# Altium schematic sheet ММС схема D650 Э3.SchDoc
size 850 x 604 mm; TypeD: Схема электрическая принципиальная; Name: ММС (схема D650)
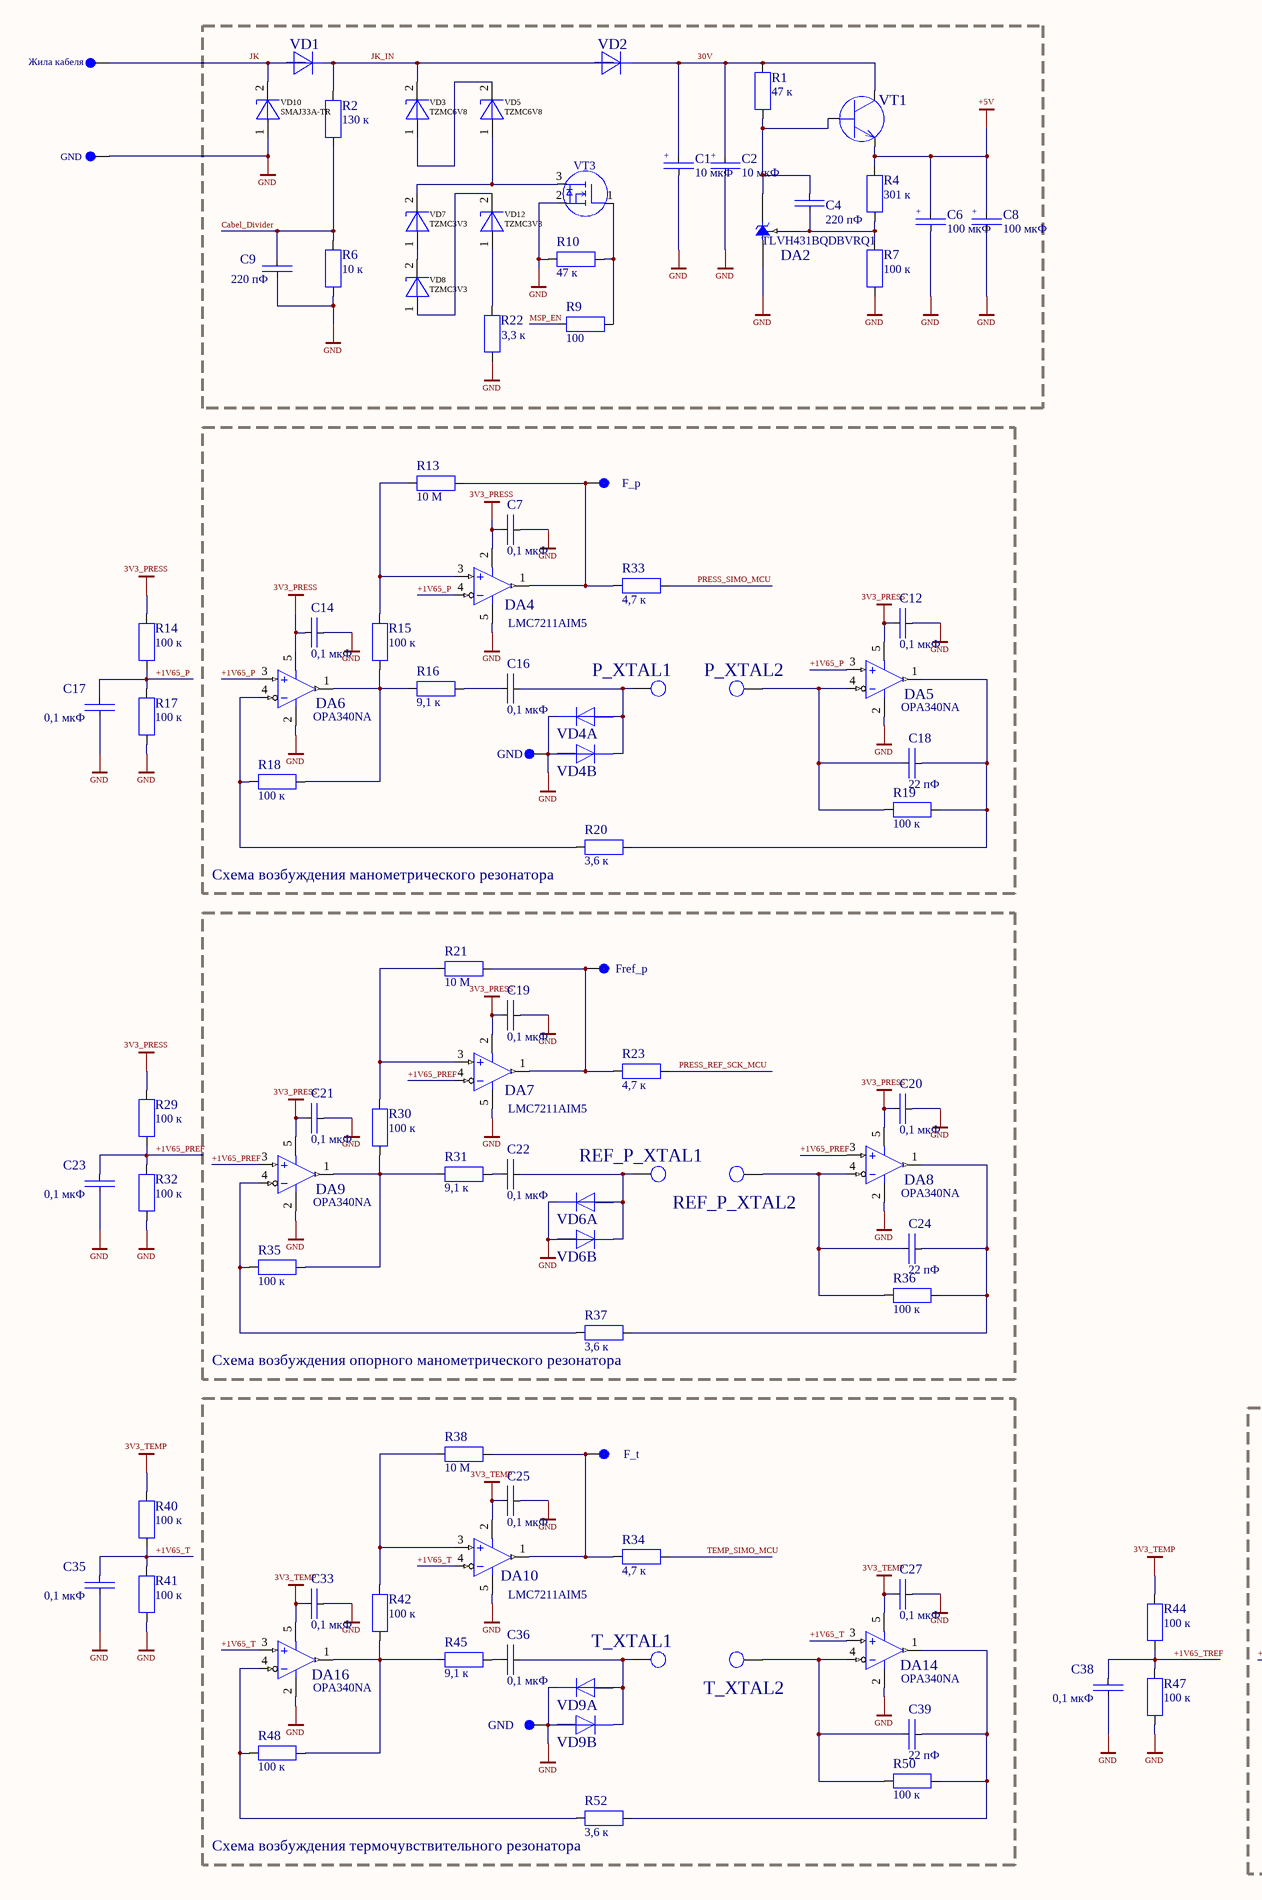
[diagram p0: ММС схема D650 Э3.SchDoc, left]
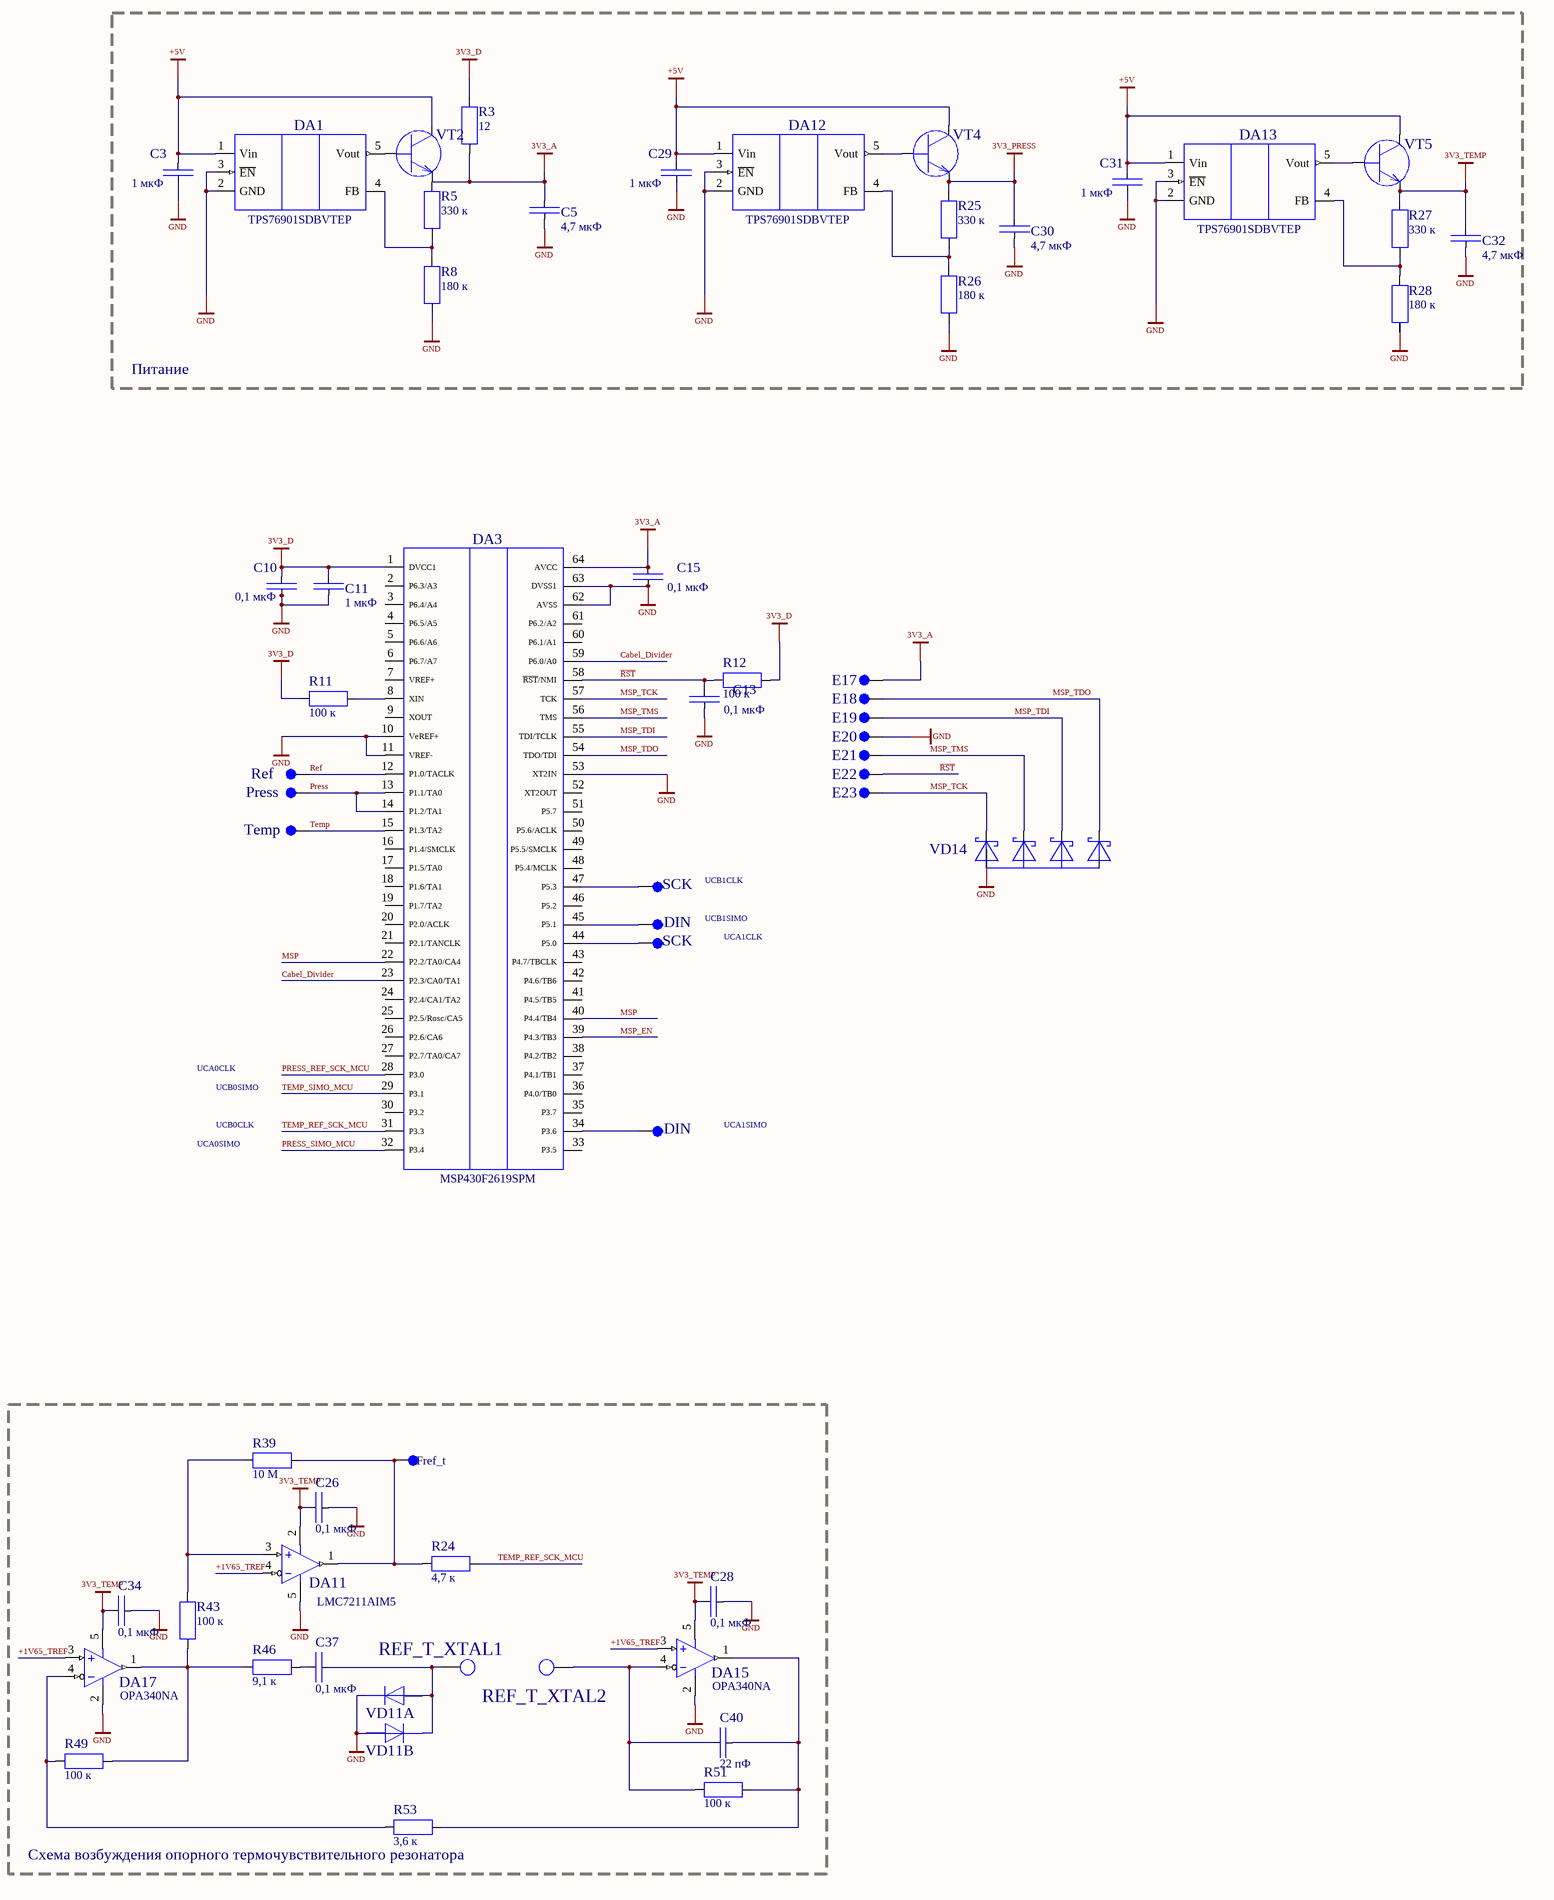
[diagram p1: ММС схема D650 Э3.SchDoc, right]

## Parts
C1  10 мкФ
C2  10 мкФ
C3  1 мкФ  [CC0603]
C4  220 пФ  [CC0603]
C5  4,7 мкФ  [CC0805]
C6  100 мкФ
C7  0,1 мкФ  [CC0603]
C8  100 мкФ
C9  220 пФ  [CC0603]
C10  0,1 мкФ  [CC0603]
C11  1 мкФ  [CC0603]
C12  0,1 мкФ  [CC0603]
C13  0,1 мкФ  [CC0603]
C14  0,1 мкФ  [CC0603]
C15  0,1 мкФ  [CC0603]
C16  0,1 мкФ  [CC0603]
C17  0,1 мкФ  [CC0603]
C18  22 пФ  [CC0603]
C19  0,1 мкФ  [CC0603]
C20  0,1 мкФ  [CC0603]
C21  0,1 мкФ  [CC0603]
C22  0,1 мкФ  [CC0603]
C23  0,1 мкФ  [CC0603]
C24  22 пФ  [CC0603]
C25  0,1 мкФ  [CC0603]
C26  0,1 мкФ  [CC0603]
C27  0,1 мкФ  [CC0603]
C28  0,1 мкФ  [CC0603]
C29  1 мкФ  [CC0603]
C30  4,7 мкФ  [CC0805]
C31  1 мкФ  [CC0603]
C32  4,7 мкФ  [CC0805]
C33  0,1 мкФ  [CC0603]
C34  0,1 мкФ  [CC0603]
C35  0,1 мкФ  [CC0603]
C36  0,1 мкФ  [CC0603]
C37  0,1 мкФ  [CC0603]
C38  0,1 мкФ  [CC0603]
C39  22 пФ  [CC0603]
C40  22 пФ  [CC0603]
DA1  TPS76901SDBVTEP  [SOT23-5]
DA2  TLVH431BQDBVRQ1  [SOT23-5]
DA3  MSP430F2619SPM  [LQFP64_SMALL PADS]
DA4  LMC7211AIM5  [SOT23-5]
DA5  OPA340NA  [SOT23-5]
DA6  OPA340NA  [SOT23-5]
DA7  LMC7211AIM5  [SOT23-5]
DA8  OPA340NA  [SOT23-5]
DA9  OPA340NA  [SOT23-5]
DA10  LMC7211AIM5  [SOT23-5]
DA11  LMC7211AIM5  [SOT23-5]
DA12  TPS76901SDBVTEP  [SOT23-5]
DA13  TPS76901SDBVTEP  [SOT23-5]
DA14  OPA340NA  [SOT23-5]
DA15  OPA340NA  [SOT23-5]
DA16  OPA340NA  [SOT23-5]
DA17  OPA340NA  [SOT23-5]
E1  Жила кабеля  [Holes_x2]  (no BOM)
E2  GND  [Holes_x2]  (no BOM)
E3  F_p  [KT08X15]  (no BOM)
E4  Fref_p  [KT08X15]  (no BOM)
E5  F_t  [KT08X15]  (no BOM)
E6  GND  [KT08X15]  (no BOM)
E7  GND  [KT08X15]  (no BOM)
E8  P_XTAL1  [HOLES_1 mm]  (no BOM)
E9  T_XTAL1  [HOLES_1 mm]  (no BOM)
E10  REF_P_XTAL1  [HOLES_1 mm]  (no BOM)
E11  P_XTAL2  [HOLES_1 mm]  (no BOM)
E12  REF_P_XTAL2  [HOLES_1 mm]  (no BOM)
E13  T_XTAL2  [HOLES_1 mm]  (no BOM)
E14  Fref_t  [KT08X15]  (no BOM)
E15  REF_T_XTAL1  [HOLES_1 mm]  (no BOM)
E16  REF_T_XTAL2  [HOLES_1 mm]  (no BOM)
E17  KP  [EDGE HOLE]  (value not drawn)  (no BOM)
E18  KP  [EDGE HOLE]  (value not drawn)  (no BOM)
E19  KP  [EDGE HOLE]  (value not drawn)  (no BOM)
E20  KP  [EDGE HOLE]  (value not drawn)  (no BOM)
E21  KP  [EDGE HOLE]  (value not drawn)  (no BOM)
E22  KP  [EDGE HOLE]  (value not drawn)  (no BOM)
E23  KP  [EDGE HOLE]  (value not drawn)  (no BOM)
E24  SCK  [0.4x0.8mm]  (no BOM)
E25  DIN  [0.4x0.8mm]  (no BOM)
E26  SCK  [0.4x0.8mm]  (no BOM)
E27  DIN  [0.4x0.8mm]  (no BOM)
E31  Ref  [0.4x0.8mm]  (no BOM)
E32  Press  [0.4x0.8mm]  (no BOM)
E33  Temp  [0.4x0.8mm]  (no BOM)
R1  47 к  [RC0805]
R2  130 к  [RC0805]
R3  12  [RC0603]
R4  301 к  [RC0603]
R5  330 к  [RC0603]
R6  10 к  [RC0603]
R7  100 к  [RC0603]
R8  180 к  [RC0603]
R9  100  [RC0603]
R10  47 к  [RC0603]
R11  100 к  [RC0603]
R12  100 к  [RC0603]
R13  10 М  [RC0603]
R14  100 к  [RC0603]
R15  100 к  [RC0603]
R16  9,1 к  [RC0603]
R17  100 к  [RC0603]
R18  100 к  [RC0603]
R19  100 к  [RC0603]
R20  3,6 к  [RC0603]
R21  10 М  [RC0603]
R22  3,3 к
R23  4,7 к  [RC0603]
R24  4,7 к  [RC0603]
R25  330 к  [RC0603]
R26  180 к  [RC0603]
R27  330 к  [RC0603]
R28  180 к  [RC0603]
R29  100 к  [RC0603]
R30  100 к  [RC0603]
R31  9,1 к  [RC0603]
R32  100 к  [RC0603]
R33  4,7 к  [RC0603]
R34  4,7 к  [RC0603]
R35  100 к  [RC0603]
R36  100 к  [RC0603]
R37  3,6 к  [RC0603]
R38  10 М  [RC0603]
R39  10 М  [RC0603]
R40  100 к  [RC0603]
R41  100 к  [RC0603]
R42  100 к  [RC0603]
R43  100 к  [RC0603]
R44  100 к  [RC0603]
R45  9,1 к  [RC0603]
R46  9,1 к  [RC0603]
R47  100 к  [RC0603]
R48  100 к  [RC0603]
R49  100 к  [RC0603]
R50  100 к  [RC0603]
R51  100 к  [RC0603]
R52  3,6 к  [RC0603]
R53  3,6 к  [RC0603]
VD1  (no value)  [SMA(DO-214AC)]
VD2  (no value)  [MiniMELF(SOD-80)]
VD3  TZMC6V8  [MiniMelf(SOD-80)]
VD4  BAV99T  [SOT523]  (value not drawn)  (parts A,B of 2)
VD5  TZMC6V8  [MiniMelf(SOD-80)]
VD6  BAV99T  [SOT523]  (value not drawn)  (parts A,B of 2)
VD7  TZMC3V3  [MiniMelf(SOD-80)]
VD8  TZMC3V3  [MiniMelf(SOD-80)]
VD9  BAV99T  [SOT523]  (value not drawn)  (parts A,B of 2)
VD10  SMAJ33A-TR  [SMA(DO-214AC)]
VD11  BAV99T  [SOT523]  (value not drawn)  (parts A,B of 2)
VD12  TZMC3V3  [MiniMelf(SOD-80)]
VD14  PESD3V3L4UG,115  [SC70-5]  (value not drawn)
VT1  (no value)  [TO92GOR]
VT2  (no value)  [TO92GOR]
VT3  (no value)  [SOT23-3]
VT4  (no value)  [TO92GOR]
VT5  (no value)  [TO92GOR]

## Blocks framed on the sheet
Питание: C3 C5 C29-C32 DA1 DA12 DA13 R3 R5 R8 R25-R28 VT2 VT4 VT5
Схема возбуждения манометрического резонатора: C7 C12 C14 C16 C18 DA4-DA6 E3 E6 E8 E11 R13 R15 R16 R18-R20 R33 VD4
Схема возбуждения опорного манометрического резонатора: C19-C22 C24 DA7-DA9 E4 E10 E12 R21 R23 R30 R31 R35-R37 VD6
Схема возбуждения термочувствительного резонатора: C25 C27 C33 C36 C39 DA10 DA14 DA16 E5 E7 E9 E13 R34 R38 R42 R45 R48 R50 R52 VD9
Схема возбуждения опорного термочувствительного резонатора: C26 C28 C34 C37 C40 DA11 DA15 DA17 E14-E16 R24 R39 R43 R46 R49 R51 R53 VD11

## Nets
3V3_A: C5.1 C15.1 DA3.64(AVCC) E17.1 R3.1 R5.2 VT2.1(E)
3V3_D: C10.1 C11.1 DA3.1(DVCC1) R3.2 R11.1 R12.2
3V3_PRESS: C7.1 C12.1 C14.1 C19.1 C20.1 C21.1 C30.1 DA4.2(V+) DA5.5(V+) DA6.5(V+) DA7.2(V+) DA8.5(V+) DA9.5(V+) R14.2 R25.2 R29.2 VT4.1(E)
3V3_TEMP: C25.1 C26.1 C27.1 C28.1 C32.1 C33.1 C34.1 DA10.2(V+) DA11.2(V+) DA14.5(V+) DA15.5(V+) DA16.5(V+) DA17.5(V+) R27.2 R40.2 R44.2 VT5.1(E)
+5V: C3.1 C6.1 C8.1 C29.1 C31.1 DA1.1(Vin) DA12.1(Vin) DA13.1(Vin) R4.2 VT1.1(E) VT2.3(K) VT4.3(K) VT5.3(K)
GND: C1.2 C2.2 C3.2 C5.2 C6.2 C7.2 C8.2 C9.2 C10.2 C11.2 C12.2 C13.2 C14.2 C15.2 C17.2 C19.2 C20.2 C21.2 C23.2 C25.2 C26.2 C27.2 C28.2 C29.2 C30.2 C31.2 C32.2 C33.2 C34.2 C35.2 C38.2 DA1.2(GND) DA1.3(~{EN}) DA2.5(A) DA3.10(VeREF+) DA3.11(VREF-) DA3.53(XT2IN) DA3.62(AVSS) DA3.63(DVSS1) DA4.5(V-) DA5.2(V-) DA6.2(V-) DA7.5(V-) DA8.2(V-) DA9.2(V-) DA10.5(V-) DA11.5(V-) DA12.2(GND) DA12.3(~{EN}) DA13.2(GND) DA13.3(~{EN}) DA14.2(V-) DA15.2(V-) DA16.2(V-) DA17.2(V-) E2.1 E6.1 E7.1 E20.1 R6.1 R7.1 R8.1 R10.1 R17.1 R22.1 R26.1 R28.1 R32.1 R41.1 R47.1 VD4.1(A2) VD4.2(K1) VD6.1(A2) VD6.2(K1) VD9.1(A2) VD9.2(K1) VD10.1(A) VD11.1(A2) VD11.2(K1) VD14.2(A) VT3.2(S)
30V: C1.1 C2.1 R1.2 VD2.2(K) VT1.3(K)
+1V65_P: C17.1 DA4.4(IN-) DA5.3(IN+) DA6.3(IN+) R14.1 R17.2
+1V65_PREF: C23.1 DA7.4(IN-) DA8.3(IN+) DA9.3(IN+) R29.1 R32.2
+1V65_T: C35.1 DA10.4(IN-) DA14.3(IN+) DA16.3(IN+) R40.1 R41.2
+1V65_TREF: C38.1 DA11.4(IN-) DA15.3(IN+) DA17.3(IN+) R44.1 R47.2
Cabel_Divider: C9.1 DA3.23(P2.3/CA0/TA1) DA3.59(P6.0/A0) R2.1 R6.2
JK: E1.1 VD1.1(A) VD10.2(K)
JK_IN: R2.2 VD1.2(K) VD2.1(A) VD3.2(K)
MSP: DA3.22(P2.2/TA0/CA4) DA3.40(P4.4/TB4)
MSP_EN: DA3.39(P4.3/TB3) R9.1
MSP_TCK: DA3.57(TCK) E23.1 VD14.1(K)
MSP_TDI: DA3.55(TDI/TCLK) E19.1 VD14.4(K)
MSP_TDO: DA3.54(TDO/TDI) E18.1 VD14.5(K)
MSP_TMS: DA3.56(TMS) E21.1 VD14.3(K)
Press: DA3.13(P1.1/TA0) DA3.14(P1.2/TA1) E32.1
PRESS_REF_SCK_MCU: DA3.28(P3.0) R23.2
PRESS_SIMO_MCU: DA3.32(P3.4) R33.2
~{RST}: C13.1 DA3.58(~{RST}/NMI) E22.1 R12.1
Ref: DA3.12(P1.0/TACLK) E31.1
Temp: DA3.15(P1.3/TA2) E33.1
TEMP_REF_SCK_MCU: DA3.31(P3.3) R24.2
TEMP_SIMO_MCU: DA3.29(P3.1) R34.2
NetC4_1: C4.1 DA2.3(K) R1.1 VT1.2(B)
NetC4_2: C4.2 DA2.4(REF) R4.1 R7.2
NetC16_1: C16.1 R16.2
NetC16_2: C16.2 E8.1 VD4.3(K2)
NetC18_1: C18.1 DA5.4(IN-) E11.1 R19.2
NetC18_2: C18.2 DA5.1(OUT) R19.1 R20.2
NetC22_1: C22.1 R31.2
NetC22_2: C22.2 E10.1 VD6.3(K2)
NetC24_1: C24.1 DA8.4(IN-) E12.1 R36.2
NetC24_2: C24.2 DA8.1(OUT) R36.1 R37.2
NetC36_1: C36.1 R45.2
NetC36_2: C36.2 E9.1 VD9.3(K2)
NetC37_1: C37.1 R46.2
NetC37_2: C37.2 E15.1 VD11.3(K2)
NetC39_1: C39.1 DA14.4(IN-) E13.1 R50.2
NetC39_2: C39.2 DA14.1(OUT) R50.1 R52.2
NetC40_1: C40.1 DA15.4(IN-) E16.1 R51.2
NetC40_2: C40.2 DA15.1(OUT) R51.1 R53.2
NetDA1_4: DA1.4(FB) R5.1 R8.2
NetDA1_5: DA1.5(Vout) VT2.2(B)
NetDA3_8: DA3.8(XIN) R11.2
NetDA3_34: DA3.34(P3.6) E27.1
NetDA3_44: DA3.44(P5.0) E26.1
NetDA3_45: DA3.45(P5.1) E25.1
NetDA3_47: DA3.47(P5.3) E24.1
NetDA4_1: DA4.1(OUT) E3.1 R13.2 R33.1
NetDA4_3: DA4.3(IN+) R13.1 R15.2
NetDA6_1: DA6.1(OUT) R15.1 R16.1 R18.1
NetDA6_4: DA6.4(IN-) R18.2 R20.1
NetDA7_1: DA7.1(OUT) E4.1 R21.2 R23.1
NetDA7_3: DA7.3(IN+) R21.1 R30.2
NetDA9_1: DA9.1(OUT) R30.1 R31.1 R35.1
NetDA9_4: DA9.4(IN-) R35.2 R37.1
NetDA10_1: DA10.1(OUT) E5.1 R34.1 R38.2
NetDA10_3: DA10.3(IN+) R38.1 R42.2
NetDA11_1: DA11.1(OUT) E14.1 R24.1 R39.2
NetDA11_3: DA11.3(IN+) R39.1 R43.2
NetDA12_4: DA12.4(FB) R25.1 R26.2
NetDA12_5: DA12.5(Vout) VT4.2(B)
NetDA13_4: DA13.4(FB) R27.1 R28.2
NetDA13_5: DA13.5(Vout) VT5.2(B)
NetDA16_1: DA16.1(OUT) R42.1 R45.1 R48.1
NetDA16_4: DA16.4(IN-) R48.2 R52.1
NetDA17_1: DA17.1(OUT) R43.1 R46.1 R49.1
NetDA17_4: DA17.4(IN-) R49.2 R53.1
NetR9_2: R9.2 R10.2 VT3.1(G)
NetR22_2: R22.2 VD12.1(A)
NetVD3_1: VD3.1(A) VD5.2(K)
NetVD5_1: VD5.1(A) VD7.2(K) VT3.3(D)
NetVD7_1: VD7.1(A) VD8.2(K)
NetVD8_1: VD8.1(A) VD12.2(K)

Not connected (* = marked no-connect by the designer): DA3 2(P6.3/A3) 3(P6.4/A4) 4(P6.5/A5) 5(P6.6/A6) 6(P6.7/A7) 7(VREF+) 9(XOUT) 16(P1.4/SMCLK) 17(P1.5/TA0) 18(P1.6/TA1) 19(P1.7/TA2) 20(P2.0/ACLK) 21(P2.1/TANCLK) 24(P2.4/CA1/TA2) 25(P2.5/Rosc/CA5) 26(P2.6/CA6) 27(P2.7/TA0/CA7) 30(P3.2) 33(P3.5) 35(P3.7) 36(P4.0/TB0) 37(P4.1/TB1) 38(P4.2/TB2) 41(P4.5/TB5) 42(P4.6/TB6) 43(P4.7/TBCLK) 46(P5.2) 48(P5.4/MCLK) 49(P5.5/SMCLK) 50(P5.6/ACLK) 51(P5.7) 52(XT2OUT) 60(P6.1/A1) 61(P6.2/A2)

## Notes on the sheet
- UCB1CLK
- UCB1SIMO
- UCA1CLK
- UCA0CLK
- UCB0SIMO
- UCA0SIMO
- UCB0CLK
- UCA1SIMO
- B
- Перв. примен.
- Справ.№
- A
- Подп. и дата.
- Инв. № дубл.
- Взам. инв. №.
- Лит.
- Масса
- Масштаб
- Разраб.
- Провер.
- Изм
- Лист
- № докум.
- Подп.
- Дата
- Инв. № подл.
- Нач.сект.
- Т.контр.
- Листов
- Копировал
- Утв.
- Н.контр.
- Формат А1
- (in symbol IDCTant0001) +
- (in symbol IDCTant0002) +

## Library data of the parts
C1 C2 = IDCTant0001: Танталовый чип конденсатор D Case; 10 мкФ; 10%; 50 В; -55..+150; PartNumber: T498D106K050ATE1K0; Manufacturer: KEMET; Package, in: D Case; Voltage, V: 50; ValueBOM: Конденсатор T498D106K050ATE1K0 KEMET; Value: 10 мкФ; ID: IDCTant0001; Tolerance: 10%; Temperature: -55..+150; BOM: Танталовый чип конденсатор D Case; 10 мкФ; 10%; 50 В; -55..+150
C3 C11 C29 C31 = IDC06030017: Керамический чип конденсатор 0603; 1 мкФ; 10%; 16 В; X8L; -55..+150; PartNumber: C1608X8L1C105K080AC; Manufacturer: TDK; Package, in: 0603; Voltage, V: 16; ValueBOM: Конденсатор C1608X8L1C105K080AC TDK; Value: 1 мкФ; ID: IDC06030017; Tolerance: 10%; TCC (Dielectric type): X8L; Temperature: -55..+150; BOM: Керамический чип конденсатор 0603; 1 мкФ; 10%; 16 В; X8L; -55..+150
C4 C9 = IDC06030018: Керамический чип конденсатор 0603; 220 пФ; 5%; 50 В; NP0; -55..+150; PartNumber: CGA3E2NP01H221J080AA; Manufacturer: TDK; Package, in: 0603; Voltage, V: 50; ValueBOM: Конденсатор CGA3E2NP01H221J080AA TDK; Value: 220 пФ; ID: IDC06030018; Tolerance: 5%; TCC (Dielectric type): NP0; Temperature: -55..+150; BOM: Керамический чип конденсатор 0603; 220 пФ; 5%; 50 В; NP0; -55..+150
C5 C30 C32 = IDC08050013: Керамический чип конденсатор 0805; 4,7 мкФ; 10%; 16 В; X8L; -55..+150; PartNumber: C2012X8L1C475K125AC; Manufacturer: TDK; Package, in: 0805; Voltage, V: 16; ValueBOM: Конденсатор C2012X8L1C475K125AC TDK; Value: 4,7 мкФ; ID: IDC08050013; Tolerance: 10%; TCC (Dielectric type): X8L; F10: -55..+150; BOM: Керамический чип конденсатор 0805; 4,7 мкФ; 10%; 16 В; X8L; -55..+150
C6 C8 = IDCTant0002: Танталовый чип конденсатор D Case; 100 мкФ; 10%; 10 В; -55..+150; PartNumber: T498D107K010ATE600; Manufacturer: KEMET; Package, in: D Case; Voltage, V: 10; ValueBOM: Конденсатор T498D107K010ATE600 KEMET; Value: 100 мкФ; ID: IDCTant0002; Tolerance: 10%; Temperature: -55..+150; BOM: Танталовый чип конденсатор D Case; 100 мкФ; 10%; 10 В; -55..+150
C7 C10 C12-C17 C19-C23 C25-C28 C33-C38 = IDC06030020: Керамический чип конденсатор 0603; 0,1 мкФ; 10%; 25 В; X8R; -55..+150; PartNumber: CGA3E2X8R1E104K080AE; Manufacturer: TDK; Package, in: 0603; Voltage, V: 25; ValueBOM: Конденсатор CGA3E2X8R1E104K080AE TDK; Value: 0,1 мкФ; ID: IDC06030020; Tolerance: 10%; TCC (Dielectric type): X8R; Temperature: -55..+150; BOM: Керамический чип конденсатор 0603; 0,1 мкФ; 10%; 25 В; X8R; -55..+150
C18 C24 C39 C40 = IDC06030023: Керамический чип конденсатор 0603; 22 пФ; 5%; 50 В; C0G; -55..+125; PartNumber: CGA3E2C0G1H220J080AA; Manufacturer: TDK; Package, in: 0603; Voltage, V: 50; ValueBOM: Конденсатор CGA3E2C0G1H220J080AA TDK; Value: 22 пФ; ID: IDC06030023; Tolerance: 5%; TCC (Dielectric type): C0G; Temperature: -55..+125; BOM: Керамический чип конденсатор 0603; 22 пФ; 5%; 50 В; C0G; -55..+125
DA1 DA12 DA13 = LDO0006: Линейный понижающий стабилизатор регулируемый 1.2..4.5В ; Uвх 5..10В; Iвых 100 mA; -50..+150; SOT23-5; Manufacturer: Texas Instruments; ValueBOM: Микросхема TPS76901SDBVTEP Texas Instruments; PartNumber: TPS76901SDBVTEP; ID: LDO0006; Package: SOT23-5; Temperature: -55..+150; ValueSch: TPS76901SDBVTEP; BOM: Линейный понижающий стабилизатор регулируемый 1.2..4.5В ; Uвх 5..10В; Iвых 100 mA; -50..+150; SOT23-5
DA2 = LDO0007: Линейный понижающий стабилизатор регулируемый 1.24..18В ; -50..+125; SOT23-5; Manufacturer: Texas Instruments; ValueBOM: Микросхема TLVH431BQDBVRQ1 Texas Instruments; PartNumber: TLVH431BQDBVRQ1; ID: LDO0007; Package: SOT23-5; Temperature: -55..+125; ValueSch: TLVH431BQDBVRQ1; BOM: Линейный понижающий стабилизатор регулируемый 1.24..18В ; -50..+125; SOT23-5
DA3 = MCU0003: Микроконтроллер 16 бит; 120 кБ flash; 4 кБ RAM; 12-Bit ADC; Dual DAC; 2 USCI; DMA; LQFP-64; -55..+150; Manufacturer: Texas Instruments; ValueBOM: Микросхема MSP430F2619SPM Texas Instruments; PartNumber: MSP430F2619SPM; ID: MCU0003; Package: LQFP-64; ValueSch: MSP430F2619SPM; BOM: Микроконтроллер 16 бит; 120 кБ flash; 4 кБ RAM; 12-Bit ADC; Dual DAC; 2 USCI; DMA; LQFP-64; -55..+150
DA4 DA7 DA10 DA11 = IDOPAMP0006: Операционный усилитель; Rail to rail; Uпит=2,7..15В; -40..+85С; SOT-23-5; Manufacturer: Texas Instruments; ValueBOM: Микросхема LMC7211AIM5 Texas Instruments; PartNumber: LMC7211AIM5; ID: IDOPAMP0006; Package: SOT-23-5; ValueSch: LMC7211AIM5; BOM: Операционный усилитель; Rail to rail; Uпит=2,7..15В; -40..+85С; SOT-23-5
DA5 DA6 DA8 DA9 DA14-DA17 = IDOPAMP0005: Операционный усилитель; Rail to rail; Uпит=2,7..5,5В; -40..+125С; SOT-23-5; Manufacturer: Texas Instruments; ValueBOM: Микросхема OPA340NA Texas Instruments; PartNumber: OPA340NA; ID: IDOPAMP0005; Package: SOT-23-5; ValueSch: OPA340NA; BOM: Операционный усилитель; Rail to rail; Uпит=2,7..5,5В; -40..+125С; SOT-23-5
E1 E2 E24-E27 E31-E33 = KP: Imbase Key: *
E3-E7 E14 = KP_3: КП
E8-E13 E15 E16 = 1KPBIG: ValueBOM: Контактная площадка; КЛАСС: Розетка; ValueSCH: Розетка 1KPBIG; Part Number: 1KPBIG; ТИП: 1KPBIG; Type: X
R1 = IDR08050004: Чип резистор 0805; 47 кОм; 1%; 100 В; 0,125; PartNumber: RC0805FR-0747KL; Manufacturer: Yageo; Package, in: 0805; Voltage, V: 100; Power, W: 0,125; ValueBOM: Чип резистор RC0805FR-0747KL Yageo; Value: 47 к; ID: IDR08050004; Tolerance: 1%; TCR (ppm/°C): 100; BOM: Чип резистор 0805; 47 кОм; 1%; 100 В; 0,125; HelpURL: https://www.yageo.com/upload/media/product/products/datasheet/rchip/PYu-RC_Group_51_RoHS_L_11.pdf
R2 = IDR08050005: Чип резистор 0805; 130 кОм; 1%; 100 В; 0,125; PartNumber: RC0805FR-07130KL; Manufacturer: Yageo; Package, in: 0805; Voltage, V: 100; Power, W: 0,125; ValueBOM: Чип резистор RC0805FR-07130KL Yageo; Value: 130 к; ID: IDR08050005; Tolerance: 1%; TCR (ppm/°C): 100; BOM: Чип резистор 0805; 130 кОм; 1%; 100 В; 0,125; HelpURL: https://www.yageo.com/upload/media/product/products/datasheet/rchip/PYu-RC_Group_51_RoHS_L_11.pdf
R3 = IDR06030009: Чип резистор 0603; 12Ом; 1%; 50 В; 0,1; PartNumber: RC0603FR-0712RL; Manufacturer: Yageo; Package, in: 0603; Voltage, V: 50; Power, W: 0,1; TCR (ppm/°C): 100; ValueBOM: Чип резистор RC0603FR-0712RL Yageo; Value: 12; ID: IDR06030009; Tolerance: 1%; BOM: Чип резистор 0603; 12Ом; 1%; 50 В; 0,1
R4 = IDR06030010: Чип резистор 0603; 301 кОм; 1%; 50 В; 0,1; PartNumber: RC0603FR-07301KL; Manufacturer: Yageo; Package, in: 0603; Voltage, V: 50; Power, W: 0,1; TCR (ppm/°C): 100; ValueBOM: Чип резистор RC0603FR-07301KL Yageo; Value: 301 к; ID: IDR06030010; Tolerance: 1%; BOM: Чип резистор 0603; 301 кОм; 1%; 50 В; 0,1
R5 R25 R27 = IDR06030011: Чип резистор 0603; 330 кОм; 1%; 50 В; 0,1; PartNumber: RC0603FR-07330KL; Manufacturer: Yageo; Package, in: 0603; Voltage, V: 50; Power, W: 0,1; TCR (ppm/°C): 100; ValueBOM: Чип резистор RC0603FR-07330KL Yageo; Value: 330 к; ID: IDR06030011; Tolerance: 1%; BOM: Чип резистор 0603; 330 кОм; 1%; 50 В; 0,1
R6 = IDR06030012: Чип резистор 0603; 10 кОм; 1%; 50 В; 0,1; PartNumber: RC0603FR-0710KL; Manufacturer: Yageo; Package, in: 0603; Voltage, V: 50; Power, W: 0,1; TCR (ppm/°C): 100; ValueBOM: Чип резистор RC0603FR-0710KL Yageo; Value: 10 к; ID: IDR06030012; Tolerance: 1%; BOM: Чип резистор 0603; 10 кОм; 1%; 50 В; 0,1
R7 R11 R12 R14 R15 R17-R19 R29 R30 R32 R35 R36 R40-R44 R47-R51 = IDR06030013: Чип резистор 0603; 100 кОм; 1%; 50 В; 0,1; PartNumber: RC0603FR-07100KL; Manufacturer: Yageo; Package, in: 0603; Voltage, V: 50; Power, W: 0,1; TCR (ppm/°C): 100; ValueBOM: Чип резистор RC0603FR-07100KL Yageo; Value: 100 к; ID: IDR06030013; Tolerance: 1%; BOM: Чип резистор 0603; 100 кОм; 1%; 50 В; 0,1
R8 R26 R28 = IDR06030014: Чип резистор 0603; 180 кОм; 1%; 50 В; 0,1; PartNumber: RC0603FR-07180KL; Manufacturer: Yageo; Package, in: 0603; Voltage, V: 50; Power, W: 0,1; TCR (ppm/°C): 100; ValueBOM: Чип резистор RC0603FR-07180KL Yageo; Value: 180 к; ID: IDR06030014; Tolerance: 1%; BOM: Чип резистор 0603; 180 кОм; 1%; 50 В; 0,1
R9 = IDR06030015: Чип резистор 0603; 100Ом; 1%; 50 В; 0,1; PartNumber: RC0603FR-07100RL; Manufacturer: Yageo; Package, in: 0603; Voltage, V: 50; Power, W: 0,1; ValueBOM: Чип резистор RC0603FR-07100RL Yageo; Value: 100; ID: IDR06030015; Tolerance: 1%; TCR (ppm/°C): 100; BOM: Чип резистор 0603; 100Ом; 1%; 50 В; 0,1
R10 = IDR06030016: Чип резистор 0603; 47 кОм; 1%; 50 В; 0,1; PartNumber: RC0603FR-0747KL; Manufacturer: Yageo; Package, in: 0603; Voltage, V: 50; Power, W: 0,1; TCR (ppm/°C): 100; ValueBOM: Чип резистор RC0603FR-0747KL Yageo; Value: 47 к; ID: IDR06030016; Tolerance: 1%; BOM: Чип резистор 0603; 47 кОм; 1%; 50 В; 0,1
R13 R21 R38 R39 = IDR06030004: Чип резистор 0603; 10 МОм; 1%; 50 В; 0,1; PartNumber: RC0603FR-0710ML; Manufacturer: Yageo; Package, in: 0603; Voltage, V: 50; Power, W: 0,1; TCR (ppm/°C): 100; ValueBOM: Чип резистор RC0603FR-0710ML Yageo; Value: 10 М; ID: IDR06030004; Tolerance: 1%; BOM: Чип резистор 0603; 10 МОм; 1%; 50 В; 0,1
R16 R31 R45 R46 = IDR06030020: Чип резистор 0603; 9,1 кОм; 1%; 50 В; 0,1; PartNumber: RC0603FR-079K1L; Manufacturer: Yageo; Package, in: 0603; Voltage, V: 50; Power, W: 0,1; TCR (ppm/°C): 100; ValueBOM: Чип резистор RC0603FR-079K1L Yageo; Value: 9,1 к; ID: IDR06030020; Tolerance: 1%; BOM: Чип резистор 0603; 9,1 кОм; 1%; 50 В; 0,1
R20 R37 R52 R53 = IDR06030021: Чип резистор 0603; 3,6 кОм; 1%; 50 В; 0,1; PartNumber: RC0603FR-073K6L; Manufacturer: Yageo; Package, in: 0603; Voltage, V: 50; Power, W: 0,1; TCR (ppm/°C): 100; ValueBOM: Чип резистор RC0603FR-073K6L Yageo; Value: 3,6 к; ID: IDR06030021; Tolerance: 1%; BOM: Чип резистор 0603; 3,6 кОм; 1%; 50 В; 0,1
R22 = IDR12060001: Чип резистор 1206; 3,3 кОм; 5%; 200 В; 0,25; PartNumber: RC1206JR-073K3L; Manufacturer: Yageo; Package, in: 1206; Voltage, V: 200; Power, W: 0,25; TCR (ppm/°C): 100; ValueBOM: Чип резистор RC1206JR-073K3L Yageo; Value: 3,3 к; ID: IDR12060001; Tolerance: 5%; BOM: Чип резистор 1206; 3,3 кОм; 5%; 200 В; 0,25
R23 R24 R33 R34 = IDR06030018: Чип резистор 0603; 4,7 кОм; 1%; 50 В; 0,1; PartNumber: RC0603FR-074K7L; Manufacturer: Yageo; Package, in: 0603; Voltage, V: 50; Power, W: 0,1; TCR (ppm/°C): 100; ValueBOM: Чип резистор RC0603FR-074K7L Yageo; Value: 4,7 к; ID: IDR06030018; Tolerance: 1%; BOM: Чип резистор 0603; 4,7 кОм; 1%; 50 В; 0,1
VD1 = VD000001: Диод If=1 А; Ur = 700В; SMA; -65C..+150C; PartNumber: US1M-13-F; Manufacturer: Diodes Incorporated; Reverce Voltage, V: 700; Current: 1; ValueBOM: Диод US1M-13-F Diodes Incorporated; ID: VD000001; Package, in: SMA; Temperature: -65C..+150C; BOM: Диод If=1 А; Ur = 700В; SMA; -65C..+150C
VD2 = VD000002: Диод If=0,5 А; Ur = 75В; MiniMELF; -65C..+175C; PartNumber: LL4148; Manufacturer: VISHAY; Reverce Voltage, V: 75; Current: 0,5; ValueBOM: Диод LL4148 VISHAY; ID: VD000002; Package, in: MiniMELF; Temperature: -65C..+175C; BOM: Диод If=0,5 А; Ur = 75В; MiniMELF; -65C..+175C
VD3 VD5 = VDZn0001: Стабилитрон Iст=5 мА; Uст = 6,8В; MiniMELF; -65C..+175C; Manufacturer: VISHAY; Voltage, V: 6,8; Current: 5; ValueBOM: Стабилитрон TZMC6V8 VISHAY; PartNumber: TZMC6V8; ID: VDZn0001; Package, in: MiniMELF; Temperature: -65C..+175C; BOM: Стабилитрон Iст=5 мА; Uст = 6,8В; MiniMELF; -65C..+175C
VD4 VD6 VD9 VD11 = BAV99T: Диод BAV99T; ValueBOM: Диод BAV99T Diodes; ГОСТ: Diodes; Type: VD; Part Number: BAV99T; КЛАСС: Диод; ValueSCH: BAV99T
VD7 VD8 VD12 = VDZn0002: Стабилитрон Iст=5 мА; Uст = 3,3В; MiniMELF; -65C..+175C; Manufacturer: VISHAY; Voltage, V: 3,3; Current: 5; ValueBOM: Стабилитрон TZMC3V3 VISHAY; PartNumber: TZMC3V3; ID: VDZn0002; Package, in: MiniMELF; Temperature: -65C..+175C; BOM: Стабилитрон Iст=5 мА; Uст = 3,3В; MiniMELF; -65C..+175C
VD10 = VDTVS0004: Однонаправленый TVS диод If= А; Ur = 33В; SMA(DO-214AC); -55C..+150C; Manufacturer: ST Microelectronics; Reverce Voltage, V: 33; ValueBOM: TVS диод SMAJ33A-TR ST Microelectronics; PartNumber: SMAJ33A-TR; ID: VDTVS0004; Package, in: SMA(DO-214AC); Temperature: -55C..+150C; BOM: Однонаправленый TVS диод If= А; Ur = 33В; SMA(DO-214AC); -55C..+150C
VD14 = VDTVS0005: Однонаправленый TVS диод If= А; Ur = 3,3В; SOT353; -65C..+150C; Manufacturer: Nexperia; Reverce Voltage, V: 3,3; ValueBOM: TVS диод PESD3V3L4UG,115 Nexperia; PartNumber: PESD3V3L4UG,115; ID: VDTVS0005; Package, in: SOT353; Temperature: -65C..+150C; BOM: Однонаправленый TVS диод If= А; Ur = 3,3В; SOT353; -65C..+150C
VT1 VT2 VT4 VT5 = IDBIPOLAR0001: Транзистор биполярный NPN; U=400 В;  I=0,5 А; TO92; -55С..+200С; PartNumber: ZTX658; Manufacturer: Diodes Inc; Voltage, V: 400; Current, A: 0,5; ValueBOM: Транзистор ZTX658 Diodes Inc; ID: IDBIPOLAR0001; Channel: NPN; Package: TO92; Temperature: -55С..+200С; BOM: Транзистор биполярный NPN; U=400 В;  I=0,5 А; TO92; -55С..+200С
VT3 = IDMOSFET0002: Транзистор MOSFET N-channel; U=60 В; R=0,245 Ом; I=4 А; SOT-23; -55С..+175С; Manufacturer: Vishay; Channel: N; Voltage, V: 60; Current, A: 4; Rds, Ohm: 0,245; ValueBOM: Транзистор SQ2364EES Vishay; ID: IDMOSFET0002; PartNumber: SQ2364EES; Package: SOT-23; Temperature: -55С..+175С; BOM: Транзистор MOSFET N-channel; U=60 В; R=0,245 Ом; I=4 А; SOT-23; -55С..+175С
E17-E23 = KP: Imbase Key: *